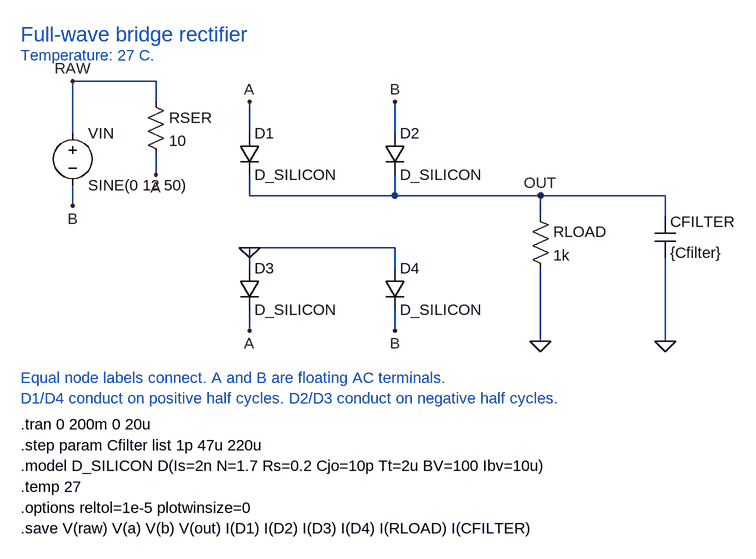
[diagram p0: schematic bridge-rectifier.asc]
bridge-rectifier.asc, the LTspice schematic file:
Version 4
SHEET 1 1280 1000
WIRE 128 176 128 96
WIRE 128 96 256 96
WIRE 256 96 256 128
WIRE 128 256 128 288
WIRE 256 208 256 240
WIRE 400 176 400 128
WIRE 624 176 624 128
WIRE 400 240 400 272
WIRE 400 272 624 272
WIRE 624 272 848 272
WIRE 848 272 1040 272
WIRE 1040 272 1040 304
WIRE 624 240 624 272
WIRE 848 272 848 304
WIRE 400 384 400 352
WIRE 400 352 624 352
WIRE 624 352 624 384
WIRE 400 448 400 480
WIRE 624 448 624 480
WIRE 848 384 848 496
WIRE 1040 368 1040 496
FLAG 128 288 B
FLAG 256 240 A
FLAG 400 128 A
FLAG 624 128 B
FLAG 848 272 OUT
FLAG 400 352 0
FLAG 400 480 A
FLAG 624 480 B
FLAG 848 496 0
FLAG 1040 496 0
FLAG 128 96 RAW
SYMBOL voltage 128 160 R0
SYMATTR InstName VIN
SYMATTR Value SINE(0 12 50)
SYMBOL res 240 112 R0
SYMATTR InstName RSER
SYMATTR Value 10
SYMBOL diode 384 176 R0
SYMATTR InstName D1
SYMATTR Value D_SILICON
SYMBOL diode 608 176 R0
SYMATTR InstName D2
SYMATTR Value D_SILICON
SYMBOL diode 384 384 R0
SYMATTR InstName D3
SYMATTR Value D_SILICON
SYMBOL diode 608 384 R0
SYMATTR InstName D4
SYMATTR Value D_SILICON
SYMBOL res 832 288 R0
SYMATTR InstName RLOAD
SYMATTR Value 1k
SYMBOL cap 1024 304 R0
SYMATTR InstName CFILTER
SYMATTR Value {Cfilter}
TEXT 48 24 Left 3 ;Full-wave bridge rectifier
TEXT 48 56 Left 2 ;Temperature: 27 C.
TEXT 48 552 Left 2 ;Equal node labels connect. A and B are floating AC terminals.
TEXT 48 584 Left 2 ;D1/D4 conduct on positive half cycles. D2/D3 conduct on negative half cycles.
TEXT 48 624 Left 2 !.tran 0 200m 0 20u
TEXT 48 656 Left 2 !.step param Cfilter list 1p 47u 220u
TEXT 48 688 Left 2 !.model D_SILICON D(Is=2n N=1.7 Rs=0.2 Cjo=10p Tt=2u BV=100 Ibv=10u)
TEXT 48 720 Left 2 !.temp 27
TEXT 48 752 Left 2 !.options reltol=1e-5 plotwinsize=0
TEXT 48 784 Left 2 !.save V(raw) V(a) V(b) V(out) I(D1) I(D2) I(D3) I(D4) I(RLOAD) I(CFILTER)

The netlist it stands for:
* bridge-rectifier.asc
VIN RAW B SINE(0 12 50)
RSER RAW A 10
D1 A OUT D_SILICON
D2 B OUT D_SILICON
D3 0 A D_SILICON
D4 0 B D_SILICON
RLOAD OUT 0 1k
CFILTER OUT 0 {Cfilter}
.model D D
.lib standard.dio
* Full-wave bridge rectifier
* Temperature: 27 C.
* Equal node labels connect. A and B are floating AC terminals.
* D1/D4 conduct on positive half cycles. D2/D3 conduct on negative half cycles.
.tran 0 200m 0 20u
.step param Cfilter list 1p 47u 220u
.model D_SILICON D(Is=2n N=1.7 Rs=0.2 Cjo=10p Tt=2u BV=100 Ibv=10u)
.temp 27
.options reltol=1e-5 plotwinsize=0
.save V(raw) V(a) V(b) V(out) I(D1) I(D2) I(D3) I(D4) I(RLOAD) I(CFILTER)
.backanno
.end